# Altium project PangolinTracker.PrjPCB
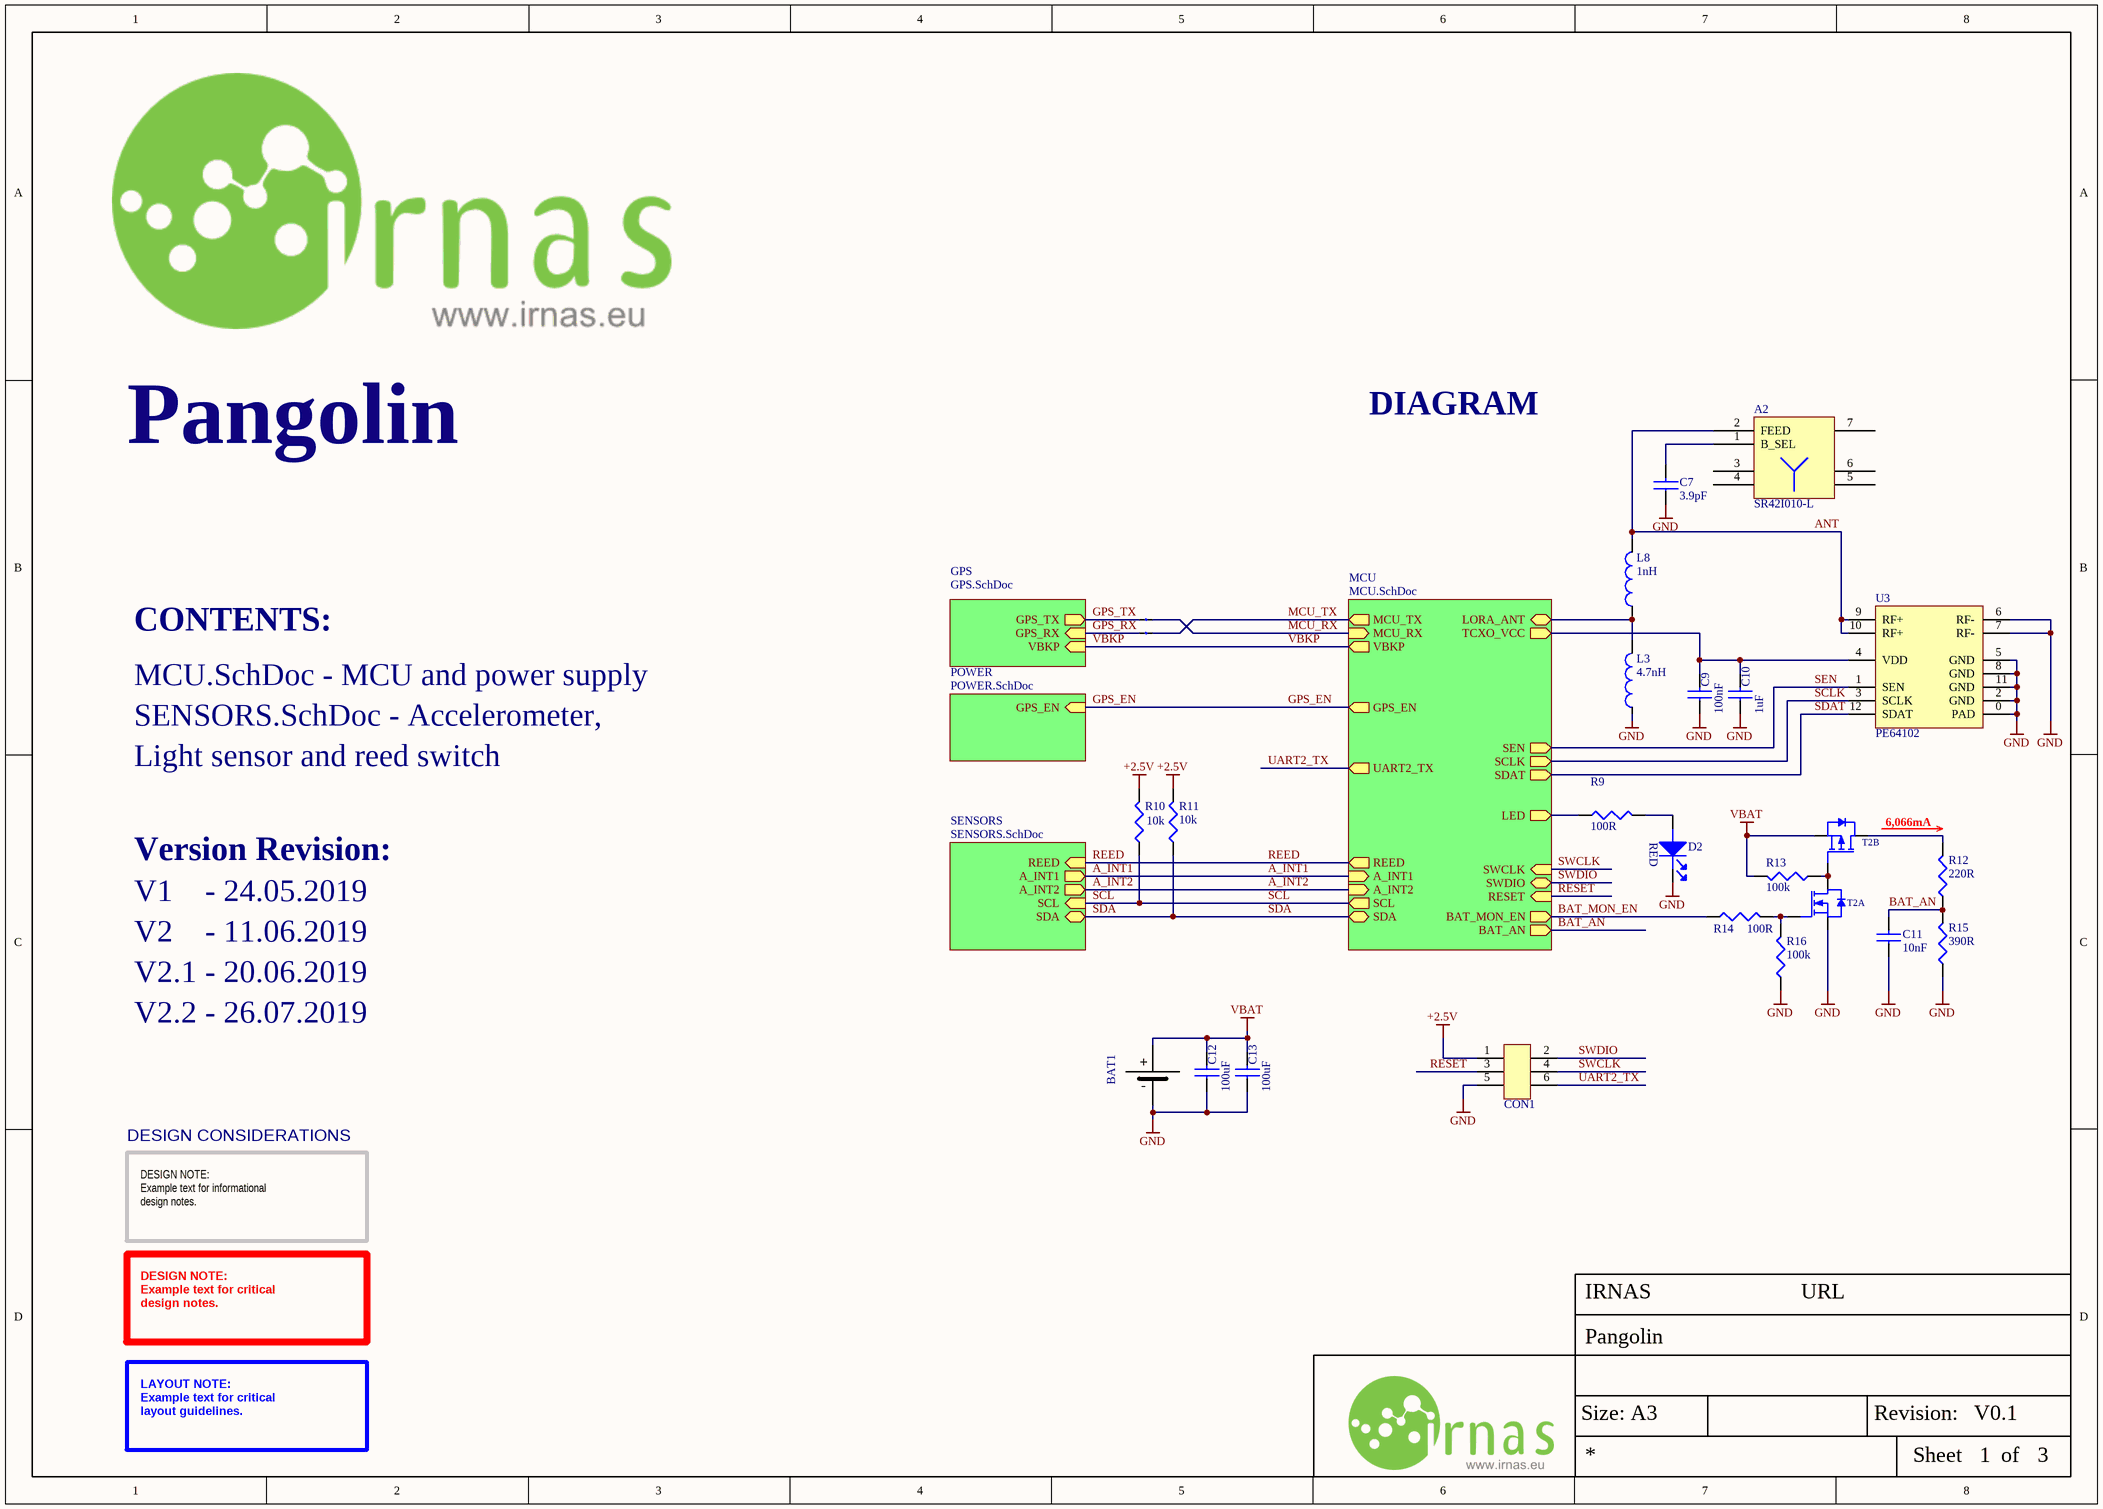
[diagram p0: MAIN.SchDoc]
Company: IRNAS; CreateDate: 20.01.2020; PCBDesigner: Aleksej Cegner; ProjectTitle: Pangolin; RevisionDate: 28.01.2020; Version: V0.1; Website: URL
1 sheet, 24 parts. Net scope: hierarchical (ports join the sheet entries above them; power ports are global).
Board files: PANGOLIN_TRACKER.PcbDoc, PANGOLIN_TRACKER_PANEL.PcbDoc

## Sheet MAIN.SchDoc
size A3; DocumentNumber: 1; SheetNumber: 1; SheetTotal: 3

### Parts
A2  SR42I010-L  [SR42I010-L]
BAT1  SAFT LS 14250PFR  [SAFT LS 14250PFR]  (value not drawn)
C7  3.9pF  [CAP0402]
C9  100nF  [CAP0402]
C10  1uF  [CAP0402]
C11  10nF  [CAP0402]
C12  100uF  [CAP0805]
C13  100uF  [CAP0805]
CON1  Tag connect  [TC2030-IDC-NL]  (value not drawn)  (no BOM)
D2  LED RED  [LED0603]  (value not drawn)
L3  4.7nH  [IND0402]
L8  1nH  [IND0402]
NT1  (no value)  [2 PIN STARPOINT]  (net tie, no BOM)
NT2  (no value)  [2 PIN STARPOINT]  (net tie, no BOM)
R9  100R  [RES0402]
R10  10k  [RES0402]
R11  10k  [RES0402]
R12  220R  [RES0402]
R13  100k  [RES0402]
R14  100R  [RES0402]
R15  390R  [RES0402]
R16  100k  [RES0402]
T2  VT6M1T2CR  [VMT6]  (value not drawn)  (parts A,B of 2)
U3  PE64102  [QFN-12]

### Sub-sheets
GPS = GPS.SchDoc (file not in this document): GPS_RX (in), VBKP (in), GPS_TX (out)
MCU = MCU.SchDoc (file not in this document): RESET (in), MCU_RX (in), SCL (out), LORA_ANT (bidir), SWDIO (bidir), GPS_EN (out), MCU_TX (out), SWCLK (in), SDA (bidir), A_INT2 (in), A_INT1 (in), REED (out), VBKP (out), BAT_AN (out), BAT_MON_EN (out), LED (out), UART2_TX (out), SDAT (out), SCLK (out), SEN (out), TCXO_VCC (out)
POWER = POWER.SchDoc (file not in this document): GPS_EN (in)
SENSORS = SENSORS.SchDoc (file not in this document): A_INT1 (out), SCL (in), SDA (bidir), A_INT2 (out), REED (in)

### Nets
+2.5V: CON1.1 R10.2 R11.2
GND: BAT1.1(Negative) C7.1 C9.1 C10.1 C11.1 C12.1 C13.1 CON1.5 D2.1(cathode) L3.1 R15.1 R16.1 T2.1(S1) U3.0(PAD) U3.2(GND) U3.5(GND) U3.6(RF-) U3.7(RF-) U3.8(GND) U3.11(GND)
VBAT: BAT1.2(Positive) C12.2 C13.2 R13.2 T2.4(S2)
A_INT1: sheet SENSORS/A_INT1, sheet MCU/A_INT1
A_INT2: sheet SENSORS/A_INT2, sheet MCU/A_INT2
ANT: A2.2(FEED) L8.2 U3.9(RF+) U3.10(RF+)
BAT_AN: C11.2 R12.1 R15.2 ; sheet MCU/BAT_AN
BAT_MON_EN: R14.1 ; sheet MCU/BAT_MON_EN
GPS_EN: sheet MCU/GPS_EN, sheet POWER/GPS_EN
GPS_RX: NT2.1 ; sheet GPS/GPS_RX
GPS_TX: NT1.1 ; sheet GPS/GPS_TX
MCU_RX: NT1.2 ; sheet MCU/MCU_RX
MCU_TX: NT2.2 ; sheet MCU/MCU_TX
REED: sheet SENSORS/REED, sheet MCU/REED
RESET: CON1.3 ; sheet MCU/RESET
SCL: R10.1 ; sheet SENSORS/SCL, sheet MCU/SCL
SCLK: U3.3(SCLK) ; sheet MCU/SCLK
SDA: R11.1 ; sheet SENSORS/SDA, sheet MCU/SDA
SDAT: U3.12(SDAT) ; sheet MCU/SDAT
SEN: U3.1(SEN) ; sheet MCU/SEN
SWCLK: CON1.4 ; sheet MCU/SWCLK
SWDIO: CON1.2 ; sheet MCU/SWDIO
UART2_TX: CON1.6 ; sheet MCU/UART2_TX
VBKP: sheet MCU/VBKP, sheet GPS/VBKP
NetA2_1: A2.1(B_SEL) C7.2
NetC9_2: C9.2 C10.2 U3.4(VDD) ; sheet MCU/TCXO_VCC
NetD2_2: D2.2(ANODE) R9.2
NetL3_2: L3.2 L8.1 ; sheet MCU/LORA_ANT
NetR9_1: R9.1 ; sheet MCU/LED
NetR12_2: R12.2 T2.3(D2)
NetR13_1: R13.1 T2.5(G2) T2.6(D1)
NetR14_2: R14.2 R16.2 T2.2(G1)

Not connected (* = marked no-connect by the designer): A2 3 4 5 6 7

### Notes on the sheet
- DIAGRAM
- CONTENTS:
- MCU.SchDoc - MCU and power supply
- SENSORS.SchDoc - Accelerometer,
- Light sensor and reed switch
- 6,066mA
- Version Revision:
- V1    - 24.05.2019
- V2    - 11.06.2019
- V2.1 - 20.06.2019
- V2.2 - 26.07.2019
- DESIGN CONSIDERATIONS
- DESIGN NOTE:
  Example text for informational
  design notes.
- DESIGN NOTE:
  Example text for critical
  design notes.
- LAYOUT NOTE:
  Example text for critical
  layout guidelines.
- Size: A3
- Revision:
- Sheet
- of
- (in symbol BAT - SAFT LS 14250PFR) +; -
- (in symbol LED - LED RED) RED

### Library data of the parts
A2 = ANT - SR42I010-L: Antenna SMD -4dBi Gain 870MHz/928MHz Automotive 7-Pin SMD T/R; Manufacturer: Antenova; Manufacturer Part Number: SR42I010-R; Stock 1: 3154; Pricing 1: 1 = 2.36000, 10 = 1.90000, 50 = 1.90000, 100 = 1.52000, 1000 = 1.07000, 10000 = 0.95900 (USD); Supplier 1: Mouser; Supplier Part Number 1: 237-SR42I010-L
BAT1 = BAT - SAFT LS 14250PFR: Battery: lithium; 3.6V; 1/2AA; 3pin,positive pole: 1pin; 1200mAh; Supplier 1: TME; Supplier Part Number 1: SAFT-LS14250PFR
C7 = C - 3.9pF/0402: 3.9 pF, 50 V, 0402 [1005 Metric], ± 0.25pF, NP0; Manufacturer: KEMET; Manufacturer Part Number: MC0402N3R9C500CT; IRNAS Part No.: /; Dielectric Material: Ceramic; Voltage Rating: 50V; Capacitance: 1.8pF; Stock 1: 8950; Pricing 1: 10=0.463, 100=0.248, 500=0.182, 2500=0.153, 5000=0.134, 10000=0.11, 50000=0.0961 (EUR); Case/Package: 0402; Case Code (Imperial): 0402; Case Code (Metric): 1005; Min Operating Temperature: -55°C; Max Operating Temperature: 125°C; Packaging: Tape and Reel; Voltage Rating (DC): 50V; Termination: SMD/SMT; Lead Free: Lead Free; ComponentLink1URL: http://www.farnell.com/datasheets/2861120.pdf?_ga=2.234267230.1320867293.1574405148-1373726713.1554121096&_gac=1.121381498.1571402529.CjwKCAjwxaXtBRBbEiwAPqPxcCedmxiKa04iNyErqeZ3YE_megEuFQhz7mFuJRxR0uEYBmhYeHxt1xoC4MkQAvD_BwE; ComponentLink1Description: Datasheet; Supplier 1: Farnell; Supplier Part Number 1: 2627407
C9 = C - 100nF/0402: MULTICOMP         MC0402X104J160CT             SMD Multilayer Ceramic Capacitor, 0402 [1005 Metric], 0.1 F, 16 V,  5%, X5R, MC Series                          New; IRNAS Part No.: /; Voltage Rating: 16V; Supplier 1: Farnell; Manufacturer: Multicomp; Manufacturer Part Number: MC0402X104J160CT; Stock 1: 3230; Pricing 1: 10=0.0139, 100=0.0108, 500=0.0076, 2500=0.0051, 5000=0.0038 (EUR); Case Code (Metric): 1005; Case Code (Imperial): 0402; Min Operating Temperature: -55°C; Max Operating Temperature: 85°C; Capacitance: 100nF; Dielectric: X5R; Packaging: Tape and Reel; Tolerance: 5%; Voltage Rating (DC): 16V; REACH SVHC: No SVHC; ComponentLink1URL: http://www.farnell.com/datasheets/2117933.pdf; ComponentLink1Description: http://www.farnell.com/datasheets/2117933.pdf; ComponentLink2URL: http://www.farnell.com/datasheets/2117900.pdf; ComponentLink2Description: http://www.farnell.com/datasheets/2117900.pdf; Supplier Part Number 1: 2627419
C10 = C - 1uF/0402: CAP CER 1UF 10V 20% X5R 0402; Manufacturer: Murata; Manufacturer Part Number: GRM155R61A105ME15D; IRNAS Part No.: /; Stock 1: 0; Pricing 1: 10=0.0379, 100=0.0266, 500=0.0156, 2500=0.0098, 5000=0.0083 (EUR); Mount: Surface Mount; Case/Package: 0402; Case Code (Metric): 1005; Case Code (Imperial): 0402; Min Operating Temperature: -55°C; Max Operating Temperature: 85°C; Capacitance: 1uF; Tolerance: 20%; Voltage Rating: 10V; Packaging: Tape and Reel; Package Quantity: 1; Dielectric: X5R; Voltage: 10V; Voltage Rating (DC): 10V; Length: 1mm; Height: 0.5mm; Width: 0.02inch; Thickness: 0.022inch; Depth: 0.5mm; Radiation Hardening: No; REACH SVHC: No SVHC; Lead Free: Lead Free; ComponentLink1URL: https://datasheet.ciiva.com/164/product-164665.pdf; ComponentLink1Description: https://datasheet.ciiva.com/164/product-164665.pdf; ComponentLink2URL: https://datasheet.ciiva.com/11616/product-11616508.pdf; ComponentLink2Description: https://datasheet.ciiva.com/11616/product-11616508.pdf; ComponentLink3URL: https://datasheet.ciiva.com/46418/1769893-46418047.pdf; ComponentLink3Description: https://datasheet.ciiva.com/46418/1769893-46418047.pdf; ComponentLink4URL: https://datasheet.ciiva.com/164/partnumbering-e-01-164666.pdf; ComponentLink4Description: https://datasheet.ciiva.com/164/partnumbering-e-01-164666.pdf; ComponentLink5URL: https://datasheet.ciiva.com/164/partnumbering-e-01-164667.pdf; ComponentLink5Description: https://datasheet.ciiva.com/164/partnumbering-e-01-164667.pdf; Supplier 1: Farnell; Supplier Part Number 1: 1740588
C11 = C - 10nF/0402: CAP CER 10000PF 16V X7R 0402; Manufacturer: Murata; Manufacturer Part Number: GRM155R71C103KA01D; IRNAS Part No.: /; Tolerance: 10%; Stock 1: 16478; Pricing 1: 10=0.0216, 100=0.0151, 500=0.0104, 2500=0.0069, 5000=0.0056 (EUR); Mount: Surface Mount; Case/Package: 0402; Number of Pins: 2; Case Code (Metric): 1005; Case Code (Imperial): 0402; Min Operating Temperature: -55°C; Max Operating Temperature: 125°C; Package Quantity: 1; Capacitance: 10nF; Voltage Rating: 16V; Packaging: Tape and Reel; Voltage Rating (DC): 16V; Dielectric: X7R; Termination: SMD/SMT; Voltage: 16V; Length: 1mm; Height: 0.5mm; Width: 0.02inch; Thickness: 0.022inch; Depth: 0.5mm; Radiation Hardening: No; REACH SVHC: No SVHC; Lead Free: Lead Free; ComponentLink1URL: https://datasheet.ciiva.com/129/partnumbering-e-01-129774.pdf; ComponentLink1Description: https://datasheet.ciiva.com/129/partnumbering-e-01-129774.pdf; ComponentLink2URL: https://datasheet.ciiva.com/129/partnumbering-e-01-129775.pdf; ComponentLink2Description: https://datasheet.ciiva.com/129/partnumbering-e-01-129775.pdf; ComponentLink3URL: https://datasheet.ciiva.com/129/product-129776.pdf; ComponentLink3Description: https://datasheet.ciiva.com/129/product-129776.pdf; ComponentLink4URL: https://datasheet.ciiva.com/18184/getdatasheetpartid-178863-18184649.pdf; ComponentLink4Description: https://datasheet.ciiva.com/18184/getdatasheetpartid-178863-18184649.pdf; ComponentLink5URL: https://datasheet.ciiva.com/22698/608985-22698415.pdf; ComponentLink5Description: https://datasheet.ciiva.com/22698/608985-22698415.pdf; ComponentLink6URL: https://datasheet.ciiva.com/7937/608985-7937614.pdf; ComponentLink6Description: https://datasheet.ciiva.com/7937/608985-7937614.pdf; Supplier 1: Farnell; Supplier Part Number 1: 2407354
C12 C13 = C - 100uF/0805: Multilayer Ceramic Capacitors MLCC - SMD/SMT 0805 100uF 4volts *Derate Voltage/Temp; Manufacturer: Murata; Manufacturer Part Number: GRM21BR60G107ME15L; IRNAS Part No.: /; Tolerance: 20%; Dielectric: X5R; Voltage Rating (DC): 4V; Dissipation Factor: 0.1%; Supplier 1: Farnell; Stock 1: 529; Pricing 1: 5=0.775, 50=0.463, 250=0.405, 500=0.289, 1500=0.243, 3000=0.229, 15000=0.21 (GBP); Mount: Surface Mount; Case/Package: 0805; Weight: 0.000335oz; Case Code (Metric): 2012; Case Code (Imperial): 0805; Dielectric Material: Ceramic; Min Operating Temperature: -55°C; Max Operating Temperature: 85°C; Packaging: Tape and Reel; Voltage Rating: 4V; Voltage: 4V; Termination: SMD/SMT; Package Quantity: 3000; Capacitance: 100uF; Length: 2mm; Height: 1.25mm; Width: 0.049inch; Thickness: 0.057inch; Depth: 1.25mm; REACH SVHC: No SVHC; Lead Free: Lead Free; ComponentLink1URL: http://www.farnell.com/datasheets/2079181.pdf; ComponentLink1Description: http://www.farnell.com/datasheets/2079181.pdf; ComponentLink2URL: http://search.murata.co.jp/Ceramy/image/img/A01X/partnumbering_e_01.pdf; ComponentLink2Description: http://search.murata.co.jp/Ceramy/image/img/A01X/partnumbering_e_01.pdf; ComponentLink3URL: http://psearch.en.murata.com/capacitor/product/GRM21BR60G107ME15%23.pdf; ComponentLink3Description: http://psearch.en.murata.com/capacitor/product/GRM21BR60G107ME15%23.pdf; ComponentLink4URL: http://www.mouser.com/ds/2/281/c02e-2905.pdf; ComponentLink4Description: http://www.mouser.com/ds/2/281/c02e-2905.pdf; Supplier Part Number 1: 2611937
CON1 = tag connecot 6 pin
D2 = LED - LED RED: BROADCOM LIMITED - HSMS-C190 - LED, RED, 10MCD, 626NM; LED Mounting: SMD; Forward Current If: 20; Forward Voltage: 2.1; Wavelength Typ: 626; Luminous Intensity: 10; Viewing Angle: 170°; Lens Shape: Rectangular; SVHC: No SVHC (17-Dec-2015)<!--FANDB--><div class="features-and-benefits-container"><div class="features-and-benefits-description"><span class="features-benefits-value">The HSMS-C190 is a HER SMD Chip LED with untinted/diffused lens, made of GaP. It is designed in an industry standard package 1.6 x 0.8mm footprint with 0.8mm profile. It is compatible with IR reflow solder processes. The small size and wide viewing angle make this LED prime choices for backlighting applications and front panel illumination especially where space is a premium.</span></div><div class="features-and-benefits-list"><ul class="features-and-benefits-list-list"><li class="features-and-benefits-list-item">Small size</li><li class="features-and-benefits-list-item">Industry standard footprint</li><li class="features-and-benefits-list-item">Compatible with IR solder</li><li class="features-and-benefits-list-item">Diffused optics</li><li class="features-and-benefits-list-item">-40 to 85; Supplier 1: Farnell; Manufacturer: BROADCOM LIMITED; Manufacturer Part Number: HSMS-C190; RoHS: YES; Stock 1: 7534; Pricing 1: 1=0.361, 10=0.256, 50=0.235, 100=0.106, 200=0.101 (GBP); LED Colour: Red; Bulb Size: -; Packaging: Cut Tape; Product Range: -; Automotive Qualification Standard: -; MSL: -; ComponentLink1URL: http://www.farnell.com/datasheets/313031.pdf; ComponentLink1Description: http://www.farnell.com/datasheets/313031.pdf; ComponentLink2URL: http://www.farnell.com/datasheets/1681524.pdf; ComponentLink2Description: http://www.farnell.com/datasheets/1681524.pdf; ComponentLink3URL: http://www.farnell.com/datasheets/2165483.pdf; ComponentLink3Description: http://www.farnell.com/datasheets/2165483.pdf; Supplier Part Number 1: 2497356
L3 L8 = L - 4.3nH/0402: Inductor RF Chip Multi-Layer 4.3nH 0.3nH 100MHz 8Q-Factor Air 300mA 210mOhm DCR 0402 Paper T/R; Manufacturer: Murata; Manufacturer Part Number: LQG15HN4N3S02D; IRNAS Part No.: /; Q Factor: 8; Self Resonant Frequency: 6GHz; Shielding: Unshielded; DC Resistance (DCR): 210mR; Stock 1: 3502; Pricing 1: 1 = 0.10000, 10 = 0.06100, 100 = 0.04040, 500 = 0.03366, 1000 = 0.02827, 2500 = 0.02423 (USD); RoHS: Yes; Mount: Surface Mount; Case/Package: 0402; Core Material: Air; Case Code (Metric): 1005; Case Code (Imperial): 0402; Min Operating Temperature: -55°C; Max Operating Temperature: 125°C; Package Quantity: 10000; Packaging: Tape and Reel; Current Rating: 300mA; Inductance: 4.3nh; Test Frequency: 100MHz; Max DC Current: 300mA; Termination: SMD/SMT; Current: 300mA; DC Current: 300mA; Military Standard: Not; Length: 1.05mm; Height: 0.5mm; Width: 0.02inch; Height - Seated (Max): 0.022inch; Depth: 0.55mm; Radiation Hardening: No; REACH SVHC: No SVHC; Lead Free: Lead Free; ComponentLink1URL: http://uk.rs-online.com/webdocs/0f10/0900766b80f10808.pdf?src-supplier=RSComponents; ComponentLink1Description: http://uk.rs-online.com/webdocs/0f10/0900766b80f10808.pdf?src-supplier=RSComponents; ComponentLink2URL: http://search.murata.co.jp/Ceramy/image/img/PDF/ENG/L0075S0083LQG15HN.pdf?src-supplier=Avnet; ComponentLink2Description: http://search.murata.co.jp/Ceramy/image/img/PDF/ENG/L0075S0083LQG15HN.pdf?src-supplier=Avnet; ComponentLink3URL: http://www.farnell.com/datasheets/66026.pdf?src-supplier=Element14; ComponentLink3Description: http://www.farnell.com/datasheets/66026.pdf?src-supplier=Element14; ComponentLink4URL: https://www.verical.com/server-webapp/html/getDatasheet?partID=31252&src-supplier=Verical; ComponentLink4Description: https://www.verical.com/server-webapp/html/getDatasheet?partID=31252&src-supplier=Verical; ComponentLink5URL: http://search.murata.co.jp/Ceramy/image/img/PDF/ENG/L0075S0083LQG15HN.pdf?src-supplier=Avnet+Europe; ComponentLink5Description: http://search.murata.co.jp/Ceramy/image/img/PDF/ENG/L0075S0083LQG15HN.pdf?src-supplier=Avnet+Europe; ComponentLink6URL: https://search.murata.co.jp/Ceramy/image/img/P02/partnumberingAT_LQ3E.pdf?src-supplier=Digi-Key; ComponentLink6Description: https://search.murata.co.jp/Ceramy/image/img/P02/partnumberingAT_LQ3E.pdf?src-supplier=Digi-Key; Supplier 1: Farnell; Supplier Part Number 1: 1711735
NT1 NT2 = NetTie: Starpoint
R9 R14 = R - 100R/0402: MULTICOMP         MCMR04X1000FTL            SMD Chip Resistor, Ceramic, MCMR Series, 100 ohm, 50 V, 0402 [1005 Metric], 62.5 mW,  1%; IRNAS Part No.: /; Temperature Coefficient: 100ppm/°C; Power Rating: 62.5mW; Voltage Rating: 50V; Supplier 1: Farnell; Manufacturer: Multicomp; Manufacturer Part Number: MCMR04X1000FTL; Stock 1: 62365; Pricing 1: 10=0.0071, 100=0.0042, 500=0.003, 2500=0.0024, 5000=0.0019 (GBP); Case/Package: 0402; Case Code (Metric): 1005; Case Code (Imperial): 0402; Resistance: 100R; Tolerance: 1%; Composition: Ceramic; Packaging: Cut Tape; Voltage Rating (DC): 50V; REACH SVHC: No SVHC; ComponentLink1URL: https://datasheet.ciiva.com/28692/1716705-28692087.pdf; ComponentLink1Description: https://datasheet.ciiva.com/28692/1716705-28692087.pdf; ComponentLink2URL: https://datasheet.ciiva.com/22708/1716705-22708156.pdf; ComponentLink2Description: https://datasheet.ciiva.com/22708/1716705-22708156.pdf; Supplier Part Number 1: 2072515
R10 R11 = R - 10k/0402: MULTICOMP         MCWR04X1002FTL             SMD Chip Resistor, Thick Film, 10 kohm, 50 V, 0402 [1005 Metric], 62.5 mW,  1%, MCWR Series; IRNAS Part No.: I-100014; Resistance: 10kR; Voltage Rating: 50V; Power Rating: 62.5mW; Temperature Coefficient: 100ppm/°C; Supplier 1: Farnell; Manufacturer: Multicomp; Manufacturer Part Number: MCWR04X1002FTL; Stock 1: 602609; Pricing 1: 10=0.0029, 100=0.0017, 500=0.0012, 2500=0.001, 5000=0.0008 (EUR); Case/Package: 0402; Case Code (Metric): 1005; Case Code (Imperial): 0402; Packaging: Cut Tape; Composition: Thick Film; Tolerance: 1%; Voltage Rating (DC): 50V; REACH SVHC: No SVHC; ComponentLink1URL: http://www.farnell.com/datasheets/1849611.pdf; ComponentLink1Description: http://www.farnell.com/datasheets/1849611.pdf; Supplier Part Number 1: 2447096
R12 = R - 220R/0402: SMD Chip Resistor, 0402 [1005 Metric], 220 ohm, CRCW e3 Series, 50 V, Thick Film, 63 mW; Manufacturer: Multicomp; IRNAS Part No.: /; Voltage Rating: 50V; Power Rating: 62.5mW; Temperature Coefficient: 400ppm/°C; Stock 1: 0; Pricing 1: 10=0.0057, 100=0.0034, 500=0.0024, 2500=0.0019, 5000=0.0015 (EUR); Case/Package: 0402; Case Code (Metric): 1005; Case Code (Imperial): 0402; Packaging: Cut Tape; Resistance: 220R; Composition: Ceramic; Voltage Rating (DC): 50V; REACH SVHC: No SVHC; ComponentLink1URL: http://www.farnell.com/datasheets/2310790.pdf?_ga=2.80708247.1822379758.1564985606-1373726713.1554121096&_gac=1.157944520.1562763802.CjwKCAjwmZbpBRAGEiwADrmVXm8xT8OHDZvJe8qZIQyyGmIuiUD-TEITatw0hIdDkyBwIXXCH7oneRoCl7cQAvD_BwE; ComponentLink1Description: Datasheet; Supplier 1: Farnell; Supplier Part Number 1: 2140704
R13 R16 = R - 100k/0402: MULTICOMP   MCWR04X1003FTL   RES, THICK FILM, 100KOHM, 1%, 0.0625W; IRNAS Part No.: I-100013; Resistance: 100kR; Power Rating: 62.5mW; Voltage Rating: 50V; Temperature Coefficient: 100ppm/°C; Supplier 1: Farnell; Manufacturer: Multicomp; Manufacturer Part Number: MCWR04X1003FTL; Stock 1: 161188; Pricing 1: 10=0.0029, 100=0.0017, 500=0.0012, 2500=0.001, 5000=0.0008 (EUR); Mount: Surface Mount; Case/Package: 0402; Case Code (Metric): 1005; Case Code (Imperial): 0402; Tolerance: 1%; Packaging: Cut Tape; Composition: Thick Film; Voltage Rating (DC): 50V; REACH SVHC: No SVHC; ComponentLink1URL: https://datasheet.ciiva.com/46386/1849611-46386524.pdf; ComponentLink1Description: https://datasheet.ciiva.com/46386/1849611-46386524.pdf; Supplier Part Number 1: 2447094
R15 = R - 390R/0402: SMD Chip Resistor, 0402 [1005 Metric], 390 ohm, MCWR Series, 50 V, Thick Film, 62.5 mW; Manufacturer: Multicomp; IRNAS Part No.: /; Voltage Rating: 50V; Power Rating: 62.5mW; Temperature Coefficient: 400ppm/°C; Stock 1: 0; Pricing 1: 10=0.0057, 100=0.0034, 500=0.0024, 2500=0.0019, 5000=0.0015 (EUR); Case/Package: 0402; Case Code (Metric): 1005; Case Code (Imperial): 0402; Packaging: Cut Tape; Resistance: 390R; Composition: Ceramic; Voltage Rating (DC): 50V; REACH SVHC: No SVHC; ComponentLink1URL: http://www.farnell.com/datasheets/2563624.pdf?_ga=2.57959210.1822379758.1564985606-1373726713.1554121096&_gac=1.48955732.1562763802.CjwKCAjwmZbpBRAGEiwADrmVXm8xT8OHDZvJe8qZIQyyGmIuiUD-TEITatw0hIdDkyBwIXXCH7oneRoCl7cQAvD_BwE; ComponentLink1Description: Datasheet; Supplier 1: Farnell; Supplier Part Number 1: 2447165
T2 = T_M - VT6M1T2CR: Dual MOSFET, N and P Channel, 100 mA, 20 V, 2.5 ohm, 4.5 V, 1 V; ELRAD Id sifra / ELRAD Id No: 597778; Opis / Description: MOSFET BSS123       /N-Channel; Komp / Device: SMD; Value: BSS123; Velikost / Size: SOT23; FIT: 0.44; Author: Ciril Golob; Date: 11.07.2018; ComponentLINK1Description: Datasheet; ComponentLINK2Description: Datasheet www; ComponentLINK1URL: c:\ELRADSVN\Altium_Library\Libraries\Active\Datasheet\BSS123.pdf; ComponentLINK2URL: http://www.onsemi.com/pub/Collateral/BSS123-D.PDF; ComponentLink1Description: Datasheet; ComponentLink1URL: http://www.farnell.com/datasheets/2198041.pdf?_ga=2.191543850.1451481302.1563774341-1373726713.1554121096&_gac=1.95045230.1562763802.CjwKCAjwmZbpBRAGEiwADrmVXm8xT8OHDZvJe8qZIQyyGmIuiUD-TEITatw0hIdDkyBwIXXCH7oneRoCl7cQAvD_BwE; Supplier 1: Farnell; Supplier Part Number 1: 2706721
U3 = RF - PE64102: RF IC Digitally Tunable Capacitor General Purpose 100MHz ~ 3GHz SPI Interface 12-QFN (2x2); Manufacturer: u-blox; Manufacturer Part Number: MAX-M8Q-0; Stock 1: 10805; Supplier 1: Digi-Key; Supplier Part Number 1: 1046-1066-1-ND

## Assembly variants
BASIC: not fitted C5 C6 C8 C26 C28 C29 C31 C35 L3